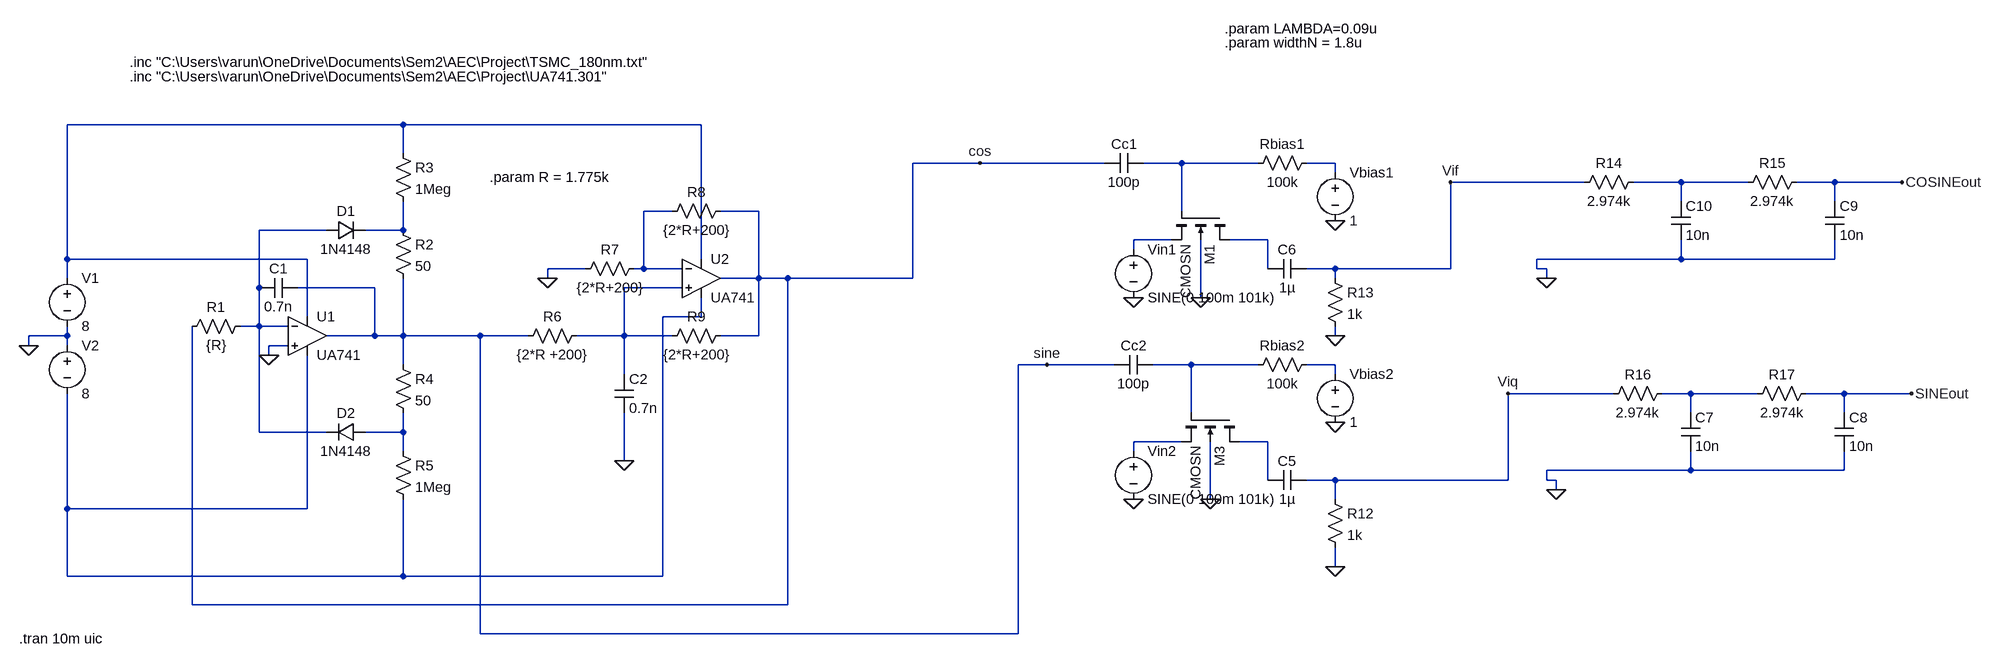
[diagram p0: schematic Circuit2.asc]
Circuit2.asc, the LTspice schematic file:
Version 4
SHEET 1 3196 824
WIRE 560 -48 0 -48
WIRE 1056 -48 560 -48
WIRE 560 0 560 -48
WIRE 1520 16 1408 16
WIRE 1728 16 1520 16
WIRE 1856 16 1792 16
WIRE 1984 16 1856 16
WIRE 2112 16 2064 16
WIRE 2112 32 2112 16
WIRE 2528 48 2304 48
WIRE 2688 48 2608 48
WIRE 2800 48 2688 48
WIRE 2944 48 2880 48
WIRE 3056 48 2944 48
WIRE 2688 80 2688 48
WIRE 2944 80 2944 48
WIRE 1008 96 960 96
WIRE 1152 96 1088 96
WIRE 1856 96 1856 16
WIRE 432 128 320 128
WIRE 560 128 560 80
WIRE 560 128 496 128
WIRE 1840 144 1776 144
WIRE 2000 144 1936 144
WIRE 1776 160 1776 144
WIRE 0 176 0 -48
WIRE 400 176 0 176
WIRE 1056 176 1056 -48
WIRE 2688 176 2688 144
WIRE 2688 176 2448 176
WIRE 2944 176 2944 144
WIRE 2944 176 2688 176
WIRE 864 192 800 192
WIRE 960 192 960 96
WIRE 960 192 944 192
WIRE 1024 192 960 192
WIRE 2000 192 2000 144
WIRE 2112 192 2064 192
WIRE 2304 192 2304 48
WIRE 2304 192 2112 192
WIRE 2448 192 2448 176
WIRE 2464 192 2448 192
WIRE 0 208 0 176
WIRE 800 208 800 192
WIRE 1152 208 1152 96
WIRE 1152 208 1088 208
WIRE 1200 208 1152 208
WIRE 1408 208 1408 16
WIRE 1408 208 1200 208
WIRE 2112 208 2112 192
WIRE 2464 208 2464 192
WIRE 320 224 320 128
WIRE 512 224 384 224
WIRE 1024 224 928 224
WIRE 1888 240 1888 144
WIRE 400 272 400 176
WIRE 1056 272 1056 240
WIRE 1056 272 992 272
WIRE 320 288 320 224
WIRE 320 288 288 288
WIRE 368 288 320 288
WIRE 0 304 0 288
WIRE 0 304 -64 304
WIRE 512 304 512 224
WIRE 512 304 432 304
WIRE 560 304 560 208
WIRE 560 304 512 304
WIRE 688 304 560 304
WIRE 768 304 688 304
WIRE 928 304 928 224
WIRE 928 304 848 304
WIRE 1008 304 928 304
WIRE 1152 304 1152 208
WIRE 1152 304 1088 304
WIRE 2112 304 2112 288
WIRE -64 320 -64 304
WIRE 0 320 0 304
WIRE 368 320 336 320
WIRE 336 336 336 320
WIRE 560 352 560 304
WIRE 1632 352 1584 352
WIRE 1744 352 1632 352
WIRE 1872 352 1808 352
WIRE 1984 352 1872 352
WIRE 2112 352 2064 352
WIRE 928 368 928 304
WIRE 2112 368 2112 352
WIRE 2576 400 2400 400
WIRE 2704 400 2656 400
WIRE 2816 400 2704 400
WIRE 2960 400 2896 400
WIRE 3072 400 2960 400
WIRE 1872 432 1872 352
WIRE 2704 432 2704 400
WIRE 2960 432 2960 400
WIRE 320 464 320 288
WIRE 432 464 320 464
WIRE 560 464 560 432
WIRE 560 464 496 464
WIRE 1856 480 1776 480
WIRE 2000 480 1952 480
WIRE 560 496 560 464
WIRE 1776 496 1776 480
WIRE 928 512 928 432
WIRE 2704 528 2704 496
WIRE 2704 528 2464 528
WIRE 2960 528 2960 496
WIRE 2960 528 2704 528
WIRE 2000 544 2000 480
WIRE 2112 544 2064 544
WIRE 2400 544 2400 400
WIRE 2400 544 2112 544
WIRE 2464 544 2464 528
WIRE 2480 544 2464 544
WIRE 2480 560 2480 544
WIRE 1904 576 1904 480
WIRE 2112 576 2112 544
WIRE 0 592 0 400
WIRE 400 592 400 336
WIRE 400 592 0 592
WIRE 2112 688 2112 656
WIRE 0 704 0 592
WIRE 560 704 560 576
WIRE 560 704 0 704
WIRE 992 704 992 272
WIRE 992 704 560 704
WIRE 208 752 208 288
WIRE 1200 752 1200 208
WIRE 1200 752 208 752
WIRE 688 800 688 304
WIRE 1584 800 1584 352
WIRE 1584 800 688 800
FLAG -64 320 0
FLAG 336 336 0
FLAG 800 208 0
FLAG 928 512 0
FLAG 1520 16 cos
FLAG 1632 352 sine
FLAG 2112 448 0
FLAG 2112 112 0
FLAG 1776 240 0
FLAG 1776 576 0
FLAG 1888 240 0
FLAG 1904 576 0
FLAG 2112 304 0
FLAG 2112 688 0
FLAG 2304 48 Vif
FLAG 2400 400 Viq
FLAG 2464 208 0
FLAG 2480 560 0
FLAG 3072 400 SINEout
FLAG 3056 48 COSINEout
SYMBOL voltage 0 192 R0
SYMATTR InstName V1
SYMATTR Value 8
SYMBOL voltage 0 304 R0
SYMATTR InstName V2
SYMATTR Value 8
SYMBOL OpAmps\\opamp2 400 240 R0
SYMATTR InstName U1
SYMATTR Value UA741
SYMBOL OpAmps\\opamp2 1056 144 R0
SYMATTR InstName U2
SYMATTR Value UA741
SYMBOL res 304 272 R90
WINDOW 0 0 56 VBottom 2
WINDOW 3 32 56 VTop 2
SYMATTR InstName R1
SYMATTR Value {R}
SYMBOL cap 384 208 R90
WINDOW 0 0 32 VBottom 2
WINDOW 3 32 32 VTop 2
SYMATTR InstName C1
SYMATTR Value 0.7n
SYMBOL diode 432 144 R270
WINDOW 0 32 32 VTop 2
WINDOW 3 0 32 VBottom 2
SYMATTR InstName D1
SYMATTR Value 1N4148
SYMBOL res 544 112 R0
SYMATTR InstName R2
SYMATTR Value 50
SYMBOL res 544 -16 R0
SYMATTR InstName R3
SYMATTR Value 1Meg
SYMBOL res 544 336 R0
SYMATTR InstName R4
SYMATTR Value 50
SYMBOL res 544 480 R0
SYMATTR InstName R5
SYMATTR Value 1Meg
SYMBOL diode 496 448 R90
WINDOW 0 0 32 VBottom 2
WINDOW 3 32 32 VTop 2
SYMATTR InstName D2
SYMATTR Value 1N4148
SYMBOL res 864 288 R90
WINDOW 0 0 56 VBottom 2
WINDOW 3 32 56 VTop 2
SYMATTR InstName R6
SYMATTR Value {2*R +200}
SYMBOL res 960 176 R90
WINDOW 0 0 56 VBottom 2
WINDOW 3 32 56 VTop 2
SYMATTR InstName R7
SYMATTR Value {2*R+200}
SYMBOL res 1104 80 R90
WINDOW 0 0 56 VBottom 2
WINDOW 3 32 56 VTop 2
SYMATTR InstName R8
SYMATTR Value {2*R+200}
SYMBOL res 1104 288 R90
WINDOW 0 0 56 VBottom 2
WINDOW 3 32 56 VTop 2
SYMATTR InstName R9
SYMATTR Value {2*R+200}
SYMBOL cap 912 368 R0
SYMATTR InstName C2
SYMATTR Value 0.7n
SYMBOL cap 1792 0 R90
WINDOW 0 0 32 VBottom 2
WINDOW 3 32 32 VTop 2
SYMATTR InstName Cc1
SYMATTR Value 100p
SYMBOL cap 1808 336 R90
WINDOW 0 0 32 VBottom 2
WINDOW 3 32 32 VTop 2
SYMATTR InstName Cc2
SYMATTR Value 100p
SYMBOL res 2080 336 R90
WINDOW 0 0 56 VBottom 2
WINDOW 3 32 56 VTop 2
SYMATTR InstName Rbias2
SYMATTR Value 100k
SYMBOL res 2080 0 R90
WINDOW 0 0 56 VBottom 2
WINDOW 3 32 56 VTop 2
SYMATTR InstName Rbias1
SYMATTR Value 100k
SYMBOL voltage 2112 16 R0
SYMATTR InstName Vbias1
SYMATTR Value 1
SYMBOL voltage 2112 352 R0
SYMATTR InstName Vbias2
SYMATTR Value 1
SYMBOL nmos4 1936 96 R90
SYMATTR InstName M1
SYMATTR Value CMOSN
SYMATTR Value2 l={2*LAMBDA} w={widthN} ad={5*widthN*LAMBDA} as={5*widthN*LAMBDA} pd={10*LAMBDA + 2*widthN} ps={10*LAMBDA + 2*widthN}
SYMBOL nmos4 1952 432 R90
SYMATTR InstName M3
SYMATTR Value CMOSN
SYMATTR Value2 l={2*LAMBDA} w={widthN} ad={5*widthN*LAMBDA} as={5*widthN*LAMBDA} pd={10*LAMBDA + 2*widthN} ps={10*LAMBDA + 2*widthN}
SYMBOL voltage 1776 480 R0
WINDOW 123 0 0 Left 0
WINDOW 39 0 0 Left 0
SYMATTR InstName Vin2
SYMATTR Value SINE(0 100m 101k)
SYMBOL voltage 1776 144 R0
WINDOW 123 0 0 Left 0
WINDOW 39 0 0 Left 0
SYMATTR InstName Vin1
SYMATTR Value SINE(0 100m 101k)
SYMBOL cap 2064 528 R90
WINDOW 0 0 32 VBottom 2
WINDOW 3 32 32 VTop 2
SYMATTR InstName C5
SYMATTR Value 1µ
SYMBOL res 2096 560 R0
SYMATTR InstName R12
SYMATTR Value 1k
SYMBOL cap 2064 176 R90
WINDOW 0 0 32 VBottom 2
WINDOW 3 32 32 VTop 2
SYMATTR InstName C6
SYMATTR Value 1µ
SYMBOL res 2096 192 R0
SYMATTR InstName R13
SYMATTR Value 1k
SYMBOL res 2624 32 R90
WINDOW 0 0 56 VBottom 2
WINDOW 3 32 56 VTop 2
SYMATTR InstName R14
SYMATTR Value 2.974k
SYMBOL res 2896 32 R90
WINDOW 0 0 56 VBottom 2
WINDOW 3 32 56 VTop 2
SYMATTR InstName R15
SYMATTR Value 2.974k
SYMBOL res 2672 384 R90
WINDOW 0 0 56 VBottom 2
WINDOW 3 32 56 VTop 2
SYMATTR InstName R16
SYMATTR Value 2.974k
SYMBOL res 2912 384 R90
WINDOW 0 0 56 VBottom 2
WINDOW 3 32 56 VTop 2
SYMATTR InstName R17
SYMATTR Value 2.974k
SYMBOL cap 2688 432 R0
SYMATTR InstName C7
SYMATTR Value 10n
SYMBOL cap 2944 432 R0
SYMATTR InstName C8
SYMATTR Value 10n
SYMBOL cap 2928 80 R0
SYMATTR InstName C9
SYMATTR Value 10n
SYMBOL cap 2672 80 R0
SYMATTR InstName C10
SYMATTR Value 10n
TEXT 104 -152 Left 2 !.inc "C:\\Users\\varun\\OneDrive\\Documents\\Sem2\\AEC\\Project\\TSMC_180nm.txt"
TEXT 104 -128 Left 2 !.inc "C:\\Users\\varun\\OneDrive\\Documents\\Sem2\\AEC\\Project\\UA741.301"
TEXT 1928 -208 Left 2 !.param LAMBDA=0.09u
TEXT 1928 -184 Left 2 !.param widthN = 1.8u
TEXT -80 808 Left 2 !.tran 10m uic
TEXT 704 40 Left 2 !.param R = 1.775k

The netlist it stands for:
* Circuit2.asc
V1 N001 0 8
V2 0 N011 8
XU1 0 N006 N001 N011 sine UA741  ; pins In+ In- V+ V- OUT
XU2 N010 N005 N001 N011 cos UA741  ; pins In+ In- V+ V- OUT
R1 N006 cos {R}
C1 sine N006 0.7n
D1 N006 N007 1N4148
R2 N007 sine 50
R3 N001 N007 1Meg
R4 sine N015 50
R5 N015 N011 1Meg
D2 N015 N006 1N4148
R6 N010 sine {2*R +200}
R7 N005 0 {2*R+200}
R8 cos N005 {2*R+200}
R9 cos N010 {2*R+200}
C2 N010 0 0.7n
Cc1 N002 cos 100p
Cc2 N012 sine 100p
Rbias2 N013 N012 100k
Rbias1 N003 N002 100k
Vbias1 N003 0 1
Vbias2 N013 0 1
M1 N009 N002 N008 0 CMOSN l={2*LAMBDA} w={widthN} ad={5*widthN*LAMBDA} as={5*widthN*LAMBDA} pd={10*LAMBDA + 2*widthN} ps={10*LAMBDA + 2*widthN}
M3 N017 N012 N016 0 CMOSN l={2*LAMBDA} w={widthN} ad={5*widthN*LAMBDA} as={5*widthN*LAMBDA} pd={10*LAMBDA + 2*widthN} ps={10*LAMBDA + 2*widthN}
Vin2 N016 0 SINE(0 100m 101k)
Vin1 N008 0 SINE(0 100m 101k)
C5 Viq N017 1µ
R12 Viq 0 1k
C6 Vif N009 1µ
R13 Vif 0 1k
R14 N004 Vif 2.974k
R15 COSINEout N004 2.974k
R16 N014 Viq 2.974k
R17 SINEout N014 2.974k
C7 N014 0 10n
C8 SINEout 0 10n
C9 COSINEout 0 10n
C10 N004 0 10n
.model D D
.lib standard.dio
.model NMOS NMOS
.model PMOS PMOS
.lib standard.mos
.inc "C:\Users\varun\OneDrive\Documents\Sem2\AEC\Project\TSMC_180nm.txt"
.inc "C:\Users\varun\OneDrive\Documents\Sem2\AEC\Project\UA741.301"
.param LAMBDA=0.09u
.param widthN = 1.8u
.tran 10m uic
.param R = 1.775k
.backanno
.end